# Altium project druino_uno.PrjPcb
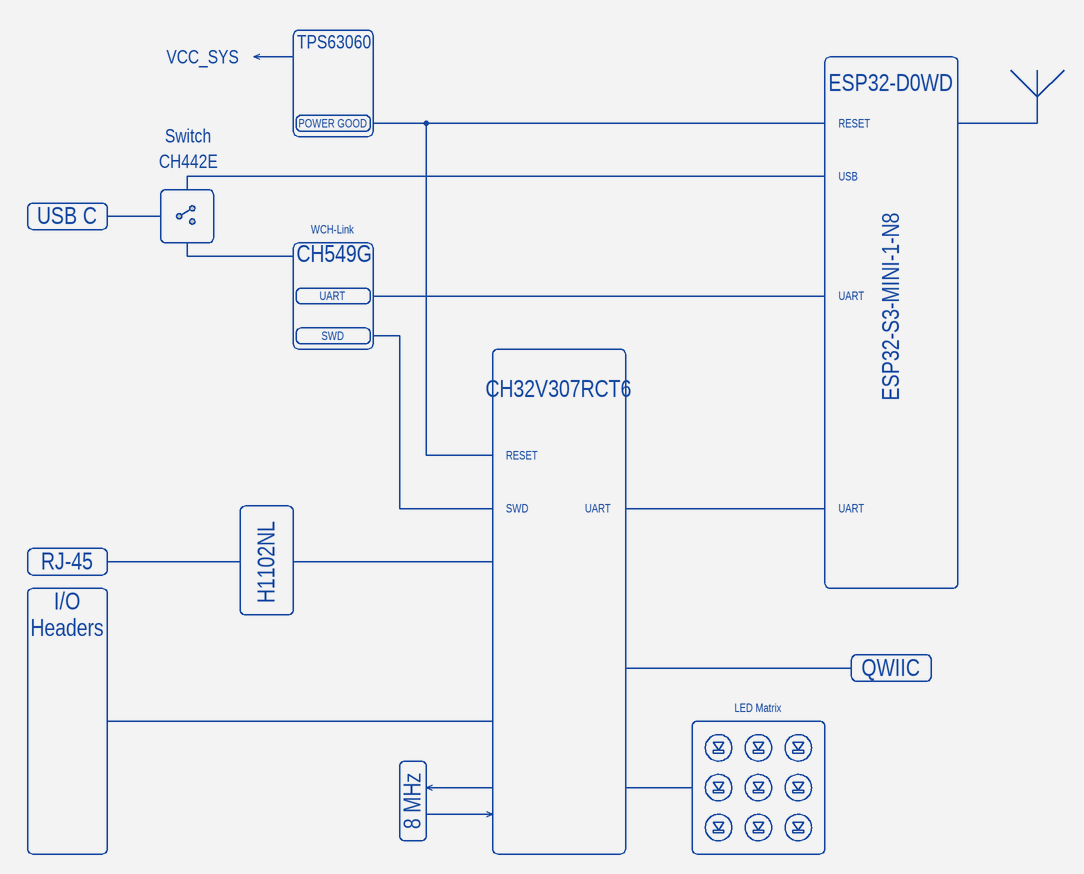
[diagram p0: p1_structure.SchDoc]
7 sheets, 210 parts. Net scope: global (net labels, ports and power ports of the same name join across sheets).
Board file: druino_uno_pcb.PcbDoc
Sheets:
  p1_structure.SchDoc
  p2_power_tree.SchDoc
  p3_mcu.SchDoc
  p4_esp32.SchDoc
  p6_wch_link.SchDoc
  p7_power.SchDoc
  p8_led_matrix.SchDoc

## Sheet p1_structure.SchDoc
size A4; Organization: ORGANIZATION; Address1: ADDRESS 1; Address2: ADDRESS 2; Address3: ADDRESS 3; Address4: ADDRESS 4; Revision: Rev. A; SheetNumber: 1; SheetTotal: 8; ENG_APP_DATE: --/--/--; DSN_APP_DATE: --/--/--; CHK_APP_DATE: --/--/--

### Notes on the sheet
- VCC_SYS
- TPS63060
- POWER GOOD
- RESET
- ESP32-D0WD
- Switch
- CH442E
- USB
- USB C
- WCH-Link
- CH549G
- UART
- SWD
- ESP32-S3-MINI-1-N8
- CH32V307RCT6
- RJ-45
- I/O
- H1102NL
- Headers
- QWIIC
- LED Matrix
- 8 MHz
- A4
- GitHub <https://github.com/kirra-cat/druino-uno>
- view on

## Sheet p2_power_tree.SchDoc
size A4; Organization: ORGANIZATION; Address1: ADDRESS 1; Address2: ADDRESS 2; Address3: ADDRESS 3; Address4: ADDRESS 4; Revision: Rev. A; SheetNumber: 2; SheetTotal: 8; ENG_APP_DATE: --/--/--; DSN_APP_DATE: --/--/--; CHK_APP_DATE: --/--/--
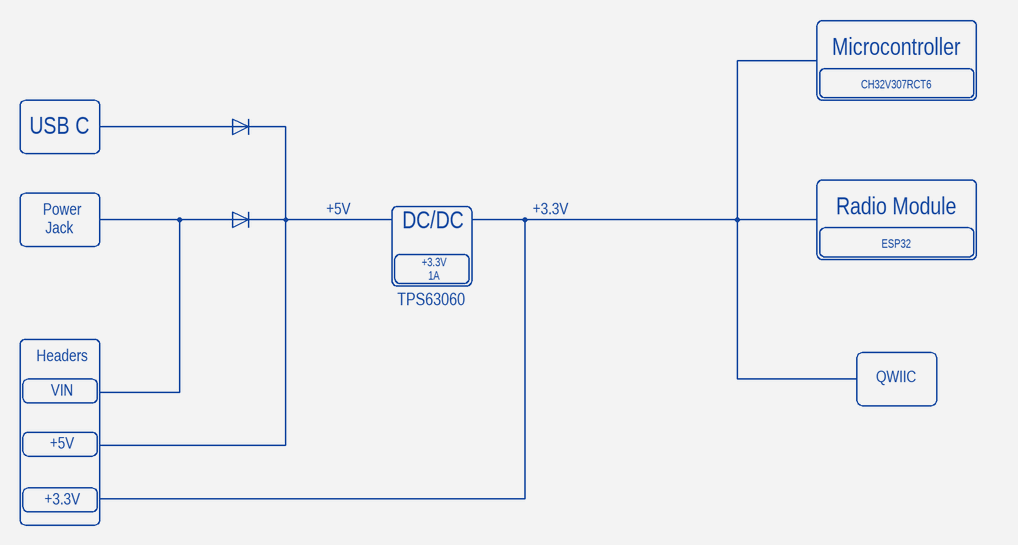
[diagram p1: p2_power_tree.SchDoc]

### Notes on the sheet
- Microcontroller
- USB C
- CH32V307RCT6
- Power
- Radio Module
- Jack
- +5V
- DC/DC
- +3.3V
- 1A
- ESP32
- TPS63060
- Headers
- VIN
- QWIIC
- A4
- GitHub <https://github.com/kirra-cat/druino-uno>
- view on

## Sheet p3_mcu.SchDoc
size A2; Organization: ORGANIZATION; Address1: ADDRESS 1; Address2: ADDRESS 2; Address3: ADDRESS 3; Address4: ADDRESS 4; Revision: Rev. A; SheetNumber: 3; SheetTotal: 8; ENG_APP_DATE: --/--/--; DSN_APP_DATE: --/--/--; CHK_APP_DATE: --/--/--
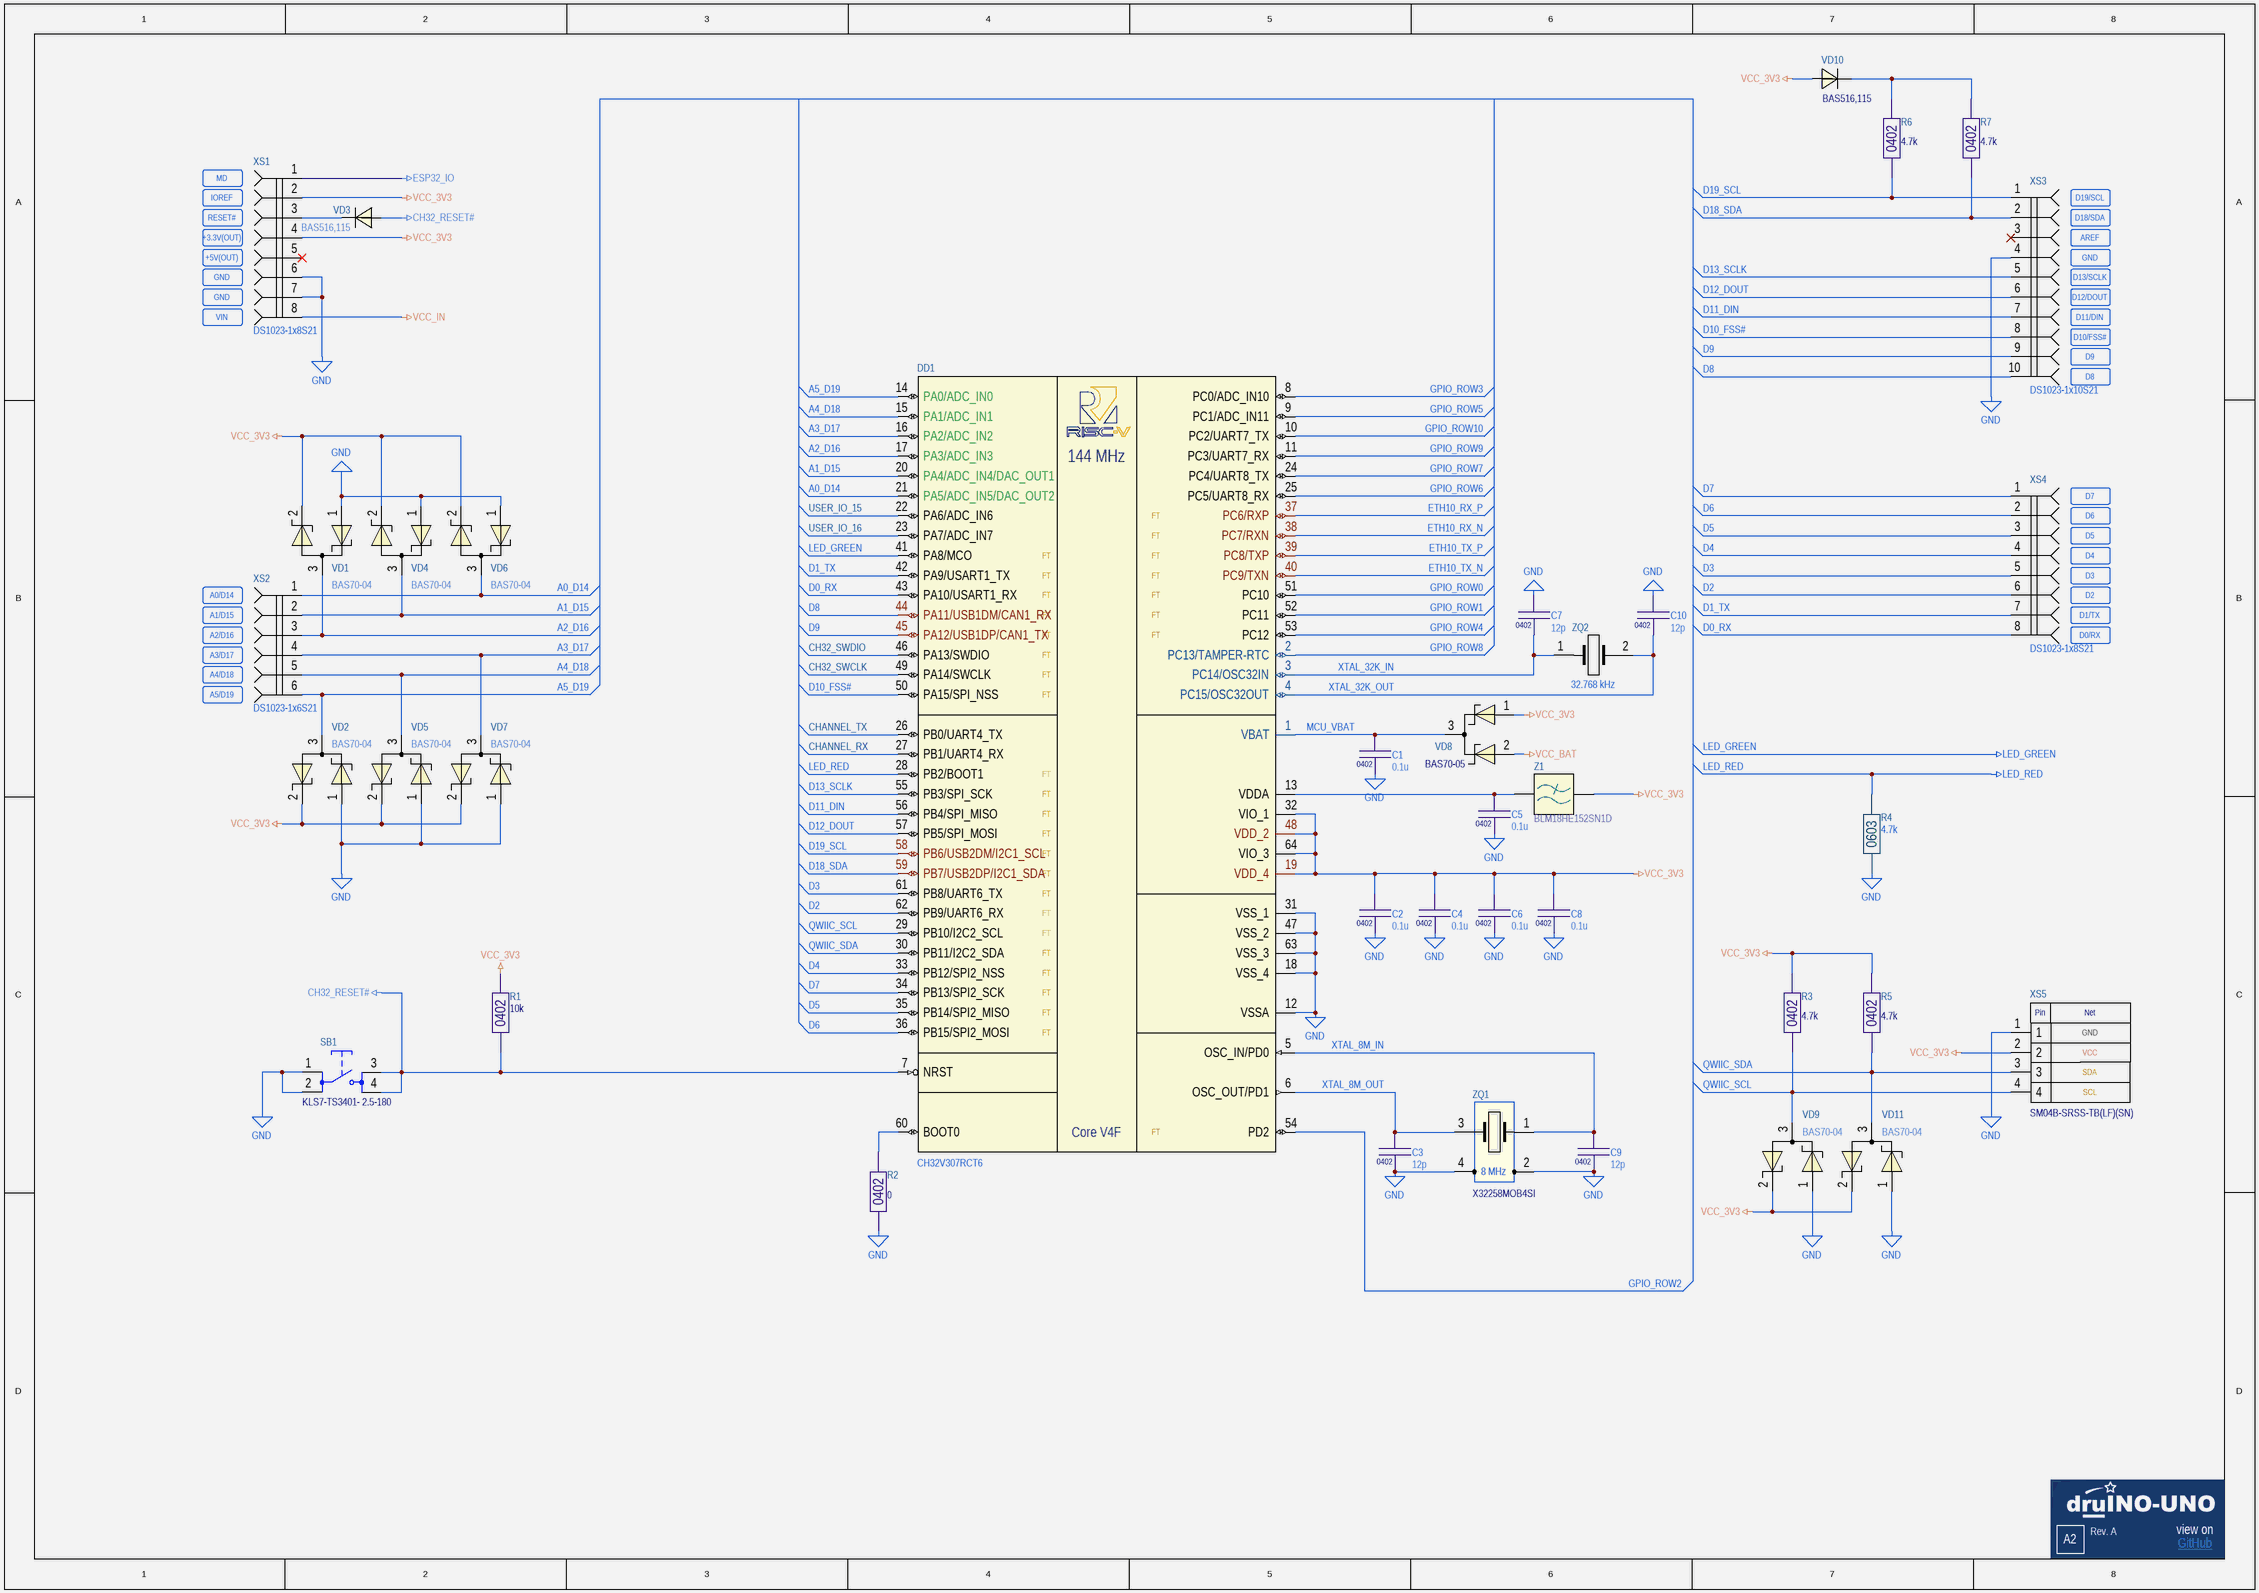
[diagram p2: p3_mcu.SchDoc]

### Parts
C1  0.1u  Package: 0402  [CAP0402]
C2  0.1u  Package: 0402  [CAP0402]
C3  12p  Package: 0402  [CAP0402]
C4  0.1u  Package: 0402  [CAP0402]
C5  0.1u  Package: 0402  [CAP0402]
C6  0.1u  Package: 0402  [CAP0402]
C7  12p  Package: 0402  [CAP0402]
C8  0.1u  Package: 0402  [CAP0402]
C9  12p  Package: 0402  [CAP0402]
C10  12p  Package: 0402  [CAP0402]
DD1  CH32V307RCT6  [LQFP64M]
R1  10k  Package: 0402  [RES0402B]
R2  0  Package: 0402  [RES0402B]
R3  4.7k  Package: 0402  [RES0402B]
R4  4.7k  Package: 0603  [RES0603B]
R5  4.7k  Package: 0402  [RES0402B]
R6  4.7k  Package: 0402  [RES0402B]
R7  4.7k  Package: 0402  [RES0402B]
SB1  KLS7-TS3401- 2.5-180  [TVAF11]
VD1  BAS70-04  [SOT23-3]
VD2  BAS70-04  [SOT23-3]
VD3  BAS516,115  [SOD-523]
VD4  BAS70-04  [SOT23-3]
VD5  BAS70-04  [SOT23-3]
VD6  BAS70-04  [SOT23-3]
VD7  BAS70-04  [SOT23-3]
VD8  BAS70-05  [SOT23-3]
VD9  BAS70-04  [SOT23-3]
VD10  BAS516,115  [SOD-523]
VD11  BAS70-04  [SOT23-3]
XS1  DS1023-1x8S21  [PBS-8(BLUE)]
XS2  DS1023-1x6S21  [PBS-6(blue)]
XS3  DS1023-1x10S21  [PBS-10(BLUE)]
XS4  DS1023-1x8S21  [PBS-8(BLUE)]
XS5  SM04B-SRSS-TB(LF)(SN)  [SM04B-SRSS-TB]
Z1  BLM18HE152SN1D  [BLM0603C]
ZQ1  X32258MOB4SI  [SMD3225]
ZQ2  X321532768KGD2SI  [YST310S]  (value not drawn)

### Nets
CH32_RESET#: DD1.7(NRST) R1.2 SB1.3 SB1.4 VD3.2
CH32_SWCLK: DD1.49(PA14/SWCLK)
CH32_SWDIO: DD1.46(PA13/SWDIO)
ESP32_IO: XS1.1
GND: C1.2 C2.2 C3.2 C4.2 C5.2 C6.2 C7.1 C8.2 C9.2 C10.1 DD1.12(VSSA) DD1.18(VSS_4) DD1.31(VSS_1) DD1.47(VSS_2) DD1.63(VSS_3) R2.2 R4.2 SB1.1 SB1.2 VD1.1(A1) VD2.1(A1) VD4.1(A1) VD5.1(A1) VD6.1(A1) VD7.1(A1) VD9.1(A1) VD11.1(A1) XS1.6 XS1.7 XS3.4 XS5.1 ZQ1.2(GND) ZQ1.4(GND)
LED_GREEN: DD1.41(PA8/MCO)
LED_RED: DD1.28(PB2/BOOT1) R4.1
VCC_3V3: C2.1 C4.1 C6.1 C8.1 DD1.19(VDD_4) DD1.32(VIO_1) DD1.48(VDD_2) DD1.64(VIO_3) R1.1 R3.1 R5.1 VD1.2(C) VD2.2(C) VD4.2(C) VD5.2(C) VD6.2(C) VD7.2(C) VD8.1(A1) VD9.2(C) VD10.2 VD11.2(C) XS1.2 XS1.4 XS5.2 Z1.1
VCC_BAT: VD8.2(C)
VCC_IN: XS1.8
A0_D14: DD1.21(PA5/ADC_IN5/DAC_OUT2) VD6.3(A2) XS2.1
A1_D15: DD1.20(PA4/ADC_IN4/DAC_OUT1) VD4.3(A2) XS2.2
A2_D16: DD1.17(PA3/ADC_IN3) VD1.3(A2) XS2.3
A3_D17: DD1.16(PA2/ADC_IN2) VD7.3(A2) XS2.4
A4_D18: DD1.15(PA1/ADC_IN1) VD5.3(A2) XS2.5
A5_D19: DD1.14(PA0/ADC_IN0) VD2.3(A2) XS2.6
CHANNEL_RX: DD1.27(PB1/UART4_RX)
CHANNEL_TX: DD1.26(PB0/UART4_TX)
D0_RX: DD1.43(PA10/USART1_RX) XS4.8
D1_TX: DD1.42(PA9/USART1_TX) XS4.7
D2: DD1.62(PB9/UART6_RX) XS4.6
D3: DD1.61(PB8/UART6_TX) XS4.5
D4: DD1.33(PB12/SPI2_NSS) XS4.4
D5: DD1.35(PB14/SPI2_MISO) XS4.3
D6: DD1.36(PB15/SPI2_MOSI) XS4.2
D7: DD1.34(PB13/SPI2_SCK) XS4.1
D8: DD1.44(PA11/USB1DM/CAN1_RX) XS3.10
D9: DD1.45(PA12/USB1DP/CAN1_TX) XS3.9
D10_FSS#: DD1.50(PA15/SPI_NSS) XS3.8
D11_DIN: DD1.56(PB4/SPI_MISO) XS3.7
D12_DOUT: DD1.57(PB5/SPI_MOSI) XS3.6
D13_SCLK: DD1.55(PB3/SPI_SCK) XS3.5
D18_SDA: DD1.59(PB7/USB2DP/I2C1_SDA) R7.2 XS3.2
D19_SCL: DD1.58(PB6/USB2DM/I2C1_SCL) R6.2 XS3.1
ETH10_RX_N: DD1.38(PC7/RXN)
ETH10_RX_P: DD1.37(PC6/RXP)
ETH10_TX_N: DD1.40(PC9/TXN)
ETH10_TX_P: DD1.39(PC8/TXP)
GPIO_ROW0: DD1.51(PC10)
GPIO_ROW1: DD1.52(PC11)
GPIO_ROW2: DD1.54(PD2)
GPIO_ROW3: DD1.8(PC0/ADC_IN10)
GPIO_ROW4: DD1.53(PC12)
GPIO_ROW5: DD1.9(PC1/ADC_IN11)
GPIO_ROW6: DD1.25(PC5/UART8_RX)
GPIO_ROW7: DD1.24(PC4/UART8_TX)
GPIO_ROW8: DD1.2(PC13/TAMPER-RTC)
GPIO_ROW9: DD1.11(PC3/UART7_RX)
GPIO_ROW10: DD1.10(PC2/UART7_TX)
MCU_VBAT: C1.1 DD1.1(VBAT) VD8.3(A2)
QWIIC_SCL: DD1.29(PB10/I2C2_SCL) R3.2 VD9.3(A2) XS5.4
QWIIC_SDA: DD1.30(PB11/I2C2_SDA) R5.2 VD11.3(A2) XS5.3
USER_IO_15: DD1.22(PA6/ADC_IN6)
USER_IO_16: DD1.23(PA7/ADC_IN7)
XTAL_8M_IN: C9.1 DD1.5(OSC_IN/PD0) ZQ1.1(XTAL0)
XTAL_8M_OUT: C3.1 DD1.6(OSC_OUT/PD1) ZQ1.3(XTAL1)
XTAL_32K_IN: C7.2 DD1.3(PC14/OSC32IN) ZQ2.1(XTAL0)
XTAL_32K_OUT: C10.2 DD1.4(PC15/OSC32OUT) ZQ2.2(XTAL1)
NetC5_1: C5.1 DD1.13(VDDA) Z1.2
NetDD1_60: DD1.60(BOOT0) R2.1
NetR6_1: R6.1 R7.1 VD10.1
NetVD3_1: VD3.1 XS1.3

Not connected (* = marked no-connect by the designer): XS1 5*; XS3 3*

### Notes on the sheet
- MD
- IOREF
- D19/SCL
- RESET#
- (near XS1) +3.3V(OUT)
- D18/SDA
- AREF
- +5V(OUT)
- GND
- D13/SCLK
- D12/DOUT
- VIN
- D11/DIN
- D10/FSS#
- D9
- D8
- D7
- (near DD1) FT
- D6
- D5
- A0/D14
- D4
- D3
- D2
- A1/D15
- A2/D16
- A3/D17
- D1/TX
- D0/RX
- A4/D18
- A5/D19
- A2
- GitHub <https://github.com/kirra-cat/druino-uno>
- view on
- (in symbol CH32V307RCT6) 144 MHz; Core V4F
- (in symbol SM04B-SRSS-TB) Pin; Net; GND; VCC; SDA; SCL
- (in symbol X32258MOB4SI) 8 MHz
- (in symbol X321532768KGD2SI) 32.768 kHz

### Library data of the parts
C1 C2 C4-C6 C8 = C0402: Capacitors 0402 package case; Part Number: TCC0402X7R104J500AT; Manufacturer: CCTC; Tolerance: ± 5 %; Dielectric: X7R; Voltage: 50 V; Value: 0.1u; Value on schem: 0.1u
C3 C7 C9 C10 = C0402: Capacitors 0402 package case; Part Number: TCC0402COG120F500AT; Manufacturer: CCTC; Tolerance: ± 1 %; Dielectric: NP0; Voltage: 50 V; Value: 12p; Value on schem: 12p
DD1 = CH32V307RCT6: RISC-V MCU 144MHz with 256KB flash, 64KB RAM; Manufacturer: WinChipHead; Package: LQFP-64; Part Number: CH32V307RCT6
R1 = R0402: Resistor 0402 package case; Part Number: RC0402FR-0710KL; Manufacturer: Yageo; Tolerance: ± 1 %; Temperature Coefficient: ±100 ppm/K; Value: 10k; Value on schem: 10k
R2 = R0402: Resistor 0402 package case; Part Number: RC0402FR-070RL; Manufacturer: Yageo; Tolerance: ± 1 %; Temperature Coefficient: ±100 ppm/K; Value: 0; Value on schem: 0
R3 R5-R7 = R0402: Resistor 0402 package case; Part Number: RC0402FR-074K7L; Manufacturer: Yageo; Tolerance: ± 1 %; Temperature Coefficient: ±100 ppm/K; Value: 4.7k; Value on schem: 4.7k
R4 = R0603: Resistor 0603 package case; Part Number: RC0603FR-074K7L; Manufacturer: Yageo; Tolerance: ± 1 %; Voltage: 100V; Temperature Coefficient: ±100/K; Value: 4.7k; Value on schem: 4.7k
SB1 = TVAF11: Tact Button SMD 4х3х2.5mm; Manufacturer: KLS; Package: 3x4mm; Part Number: KLS7-TS3401- 2.5-180
VD1 VD2 VD4-VD7 VD9 VD11 = BAS70-04: Small Signal Schottky Diodes; Manufacturer: Diodes Incorporated; Part Number: BAS70-04; Package: SOT23-3
VD3 VD10 = BAS516,115: High-speed switching diode; Manufacturer: NXP USA Inc.; Package: SOD-523; Part Number: BAS516,115
VD8 = BAS70-05: Small Signal Schottky Diodes; Manufacturer: Diodes Incorporated; Part Number: BAS70-05; Package: SOT23-3
XS1 XS4 = DS1023-1x8S21: 2.54mm Female Header V/T Type, H = 8.5mm; Manufacturer: Connfly; Part Number: DS1023-1x8S21
XS2 = DS1023-1x6S21: 2.54mm Female Header V/T Type, H = 8.5mm; Manufacturer: Connfly; Part Number: DS1023-1x6S21
XS3 = DS1023-1x10S21: 2.54mm Female Header V/T Type, H = 8.5mm; Manufacturer: Connfly; Part Number: DS1023-1x10S21
XS5 = SM04B-SRSS-TB: CONNECTOR, HEADER, SMT, R/A, 1MM, 4WAY; Manufacturer: JST; Part Number: SM04B-SRSS-TB(LF)(SN)
Z1 = BLM18HE152SN1D: Power line filter, imperdance 1500 Ohm @100MHz (current 0.5A); Manufacturer: Murata; Part Number: BLM18HE152SN1D; Package: 0603
ZQ1 = X32258MOB4SI: Quartz Crystal 8 MHz; Manufacturer: YXC; Load Capacitance: 12pF; Frequency Tolerance: ±20ppm; Frequency Stability: ±30ppm; ESR (Equivalent Series Resistance): 70 Ohms; Operating Mode: Fundamental; Part Number: X32258MOB4SI; Package: SMD3225
ZQ2 = X321532768KGD2SI: Quartz Crystal 32768 Hz; Manufacturer: YXC; Load Capacitance: 12.5 pF; Frequency Tolerance: ±20ppm; Frequency Stability: ±30ppm; ESR (Equivalent Series Resistance): 70 Ohms; Operating Mode: Fundamental; Part Number: X321532768KGD2SI; Package: SMD3215

## Sheet p4_esp32.SchDoc
size A2; Organization: ORGANIZATION; Address1: ADDRESS 1; Address2: ADDRESS 2; Address3: ADDRESS 3; Address4: ADDRESS 4; Revision: Rev. A; SheetNumber: 4; SheetTotal: 8; ENG_APP_DATE: --/--/--; DSN_APP_DATE: --/--/--; CHK_APP_DATE: --/--/--
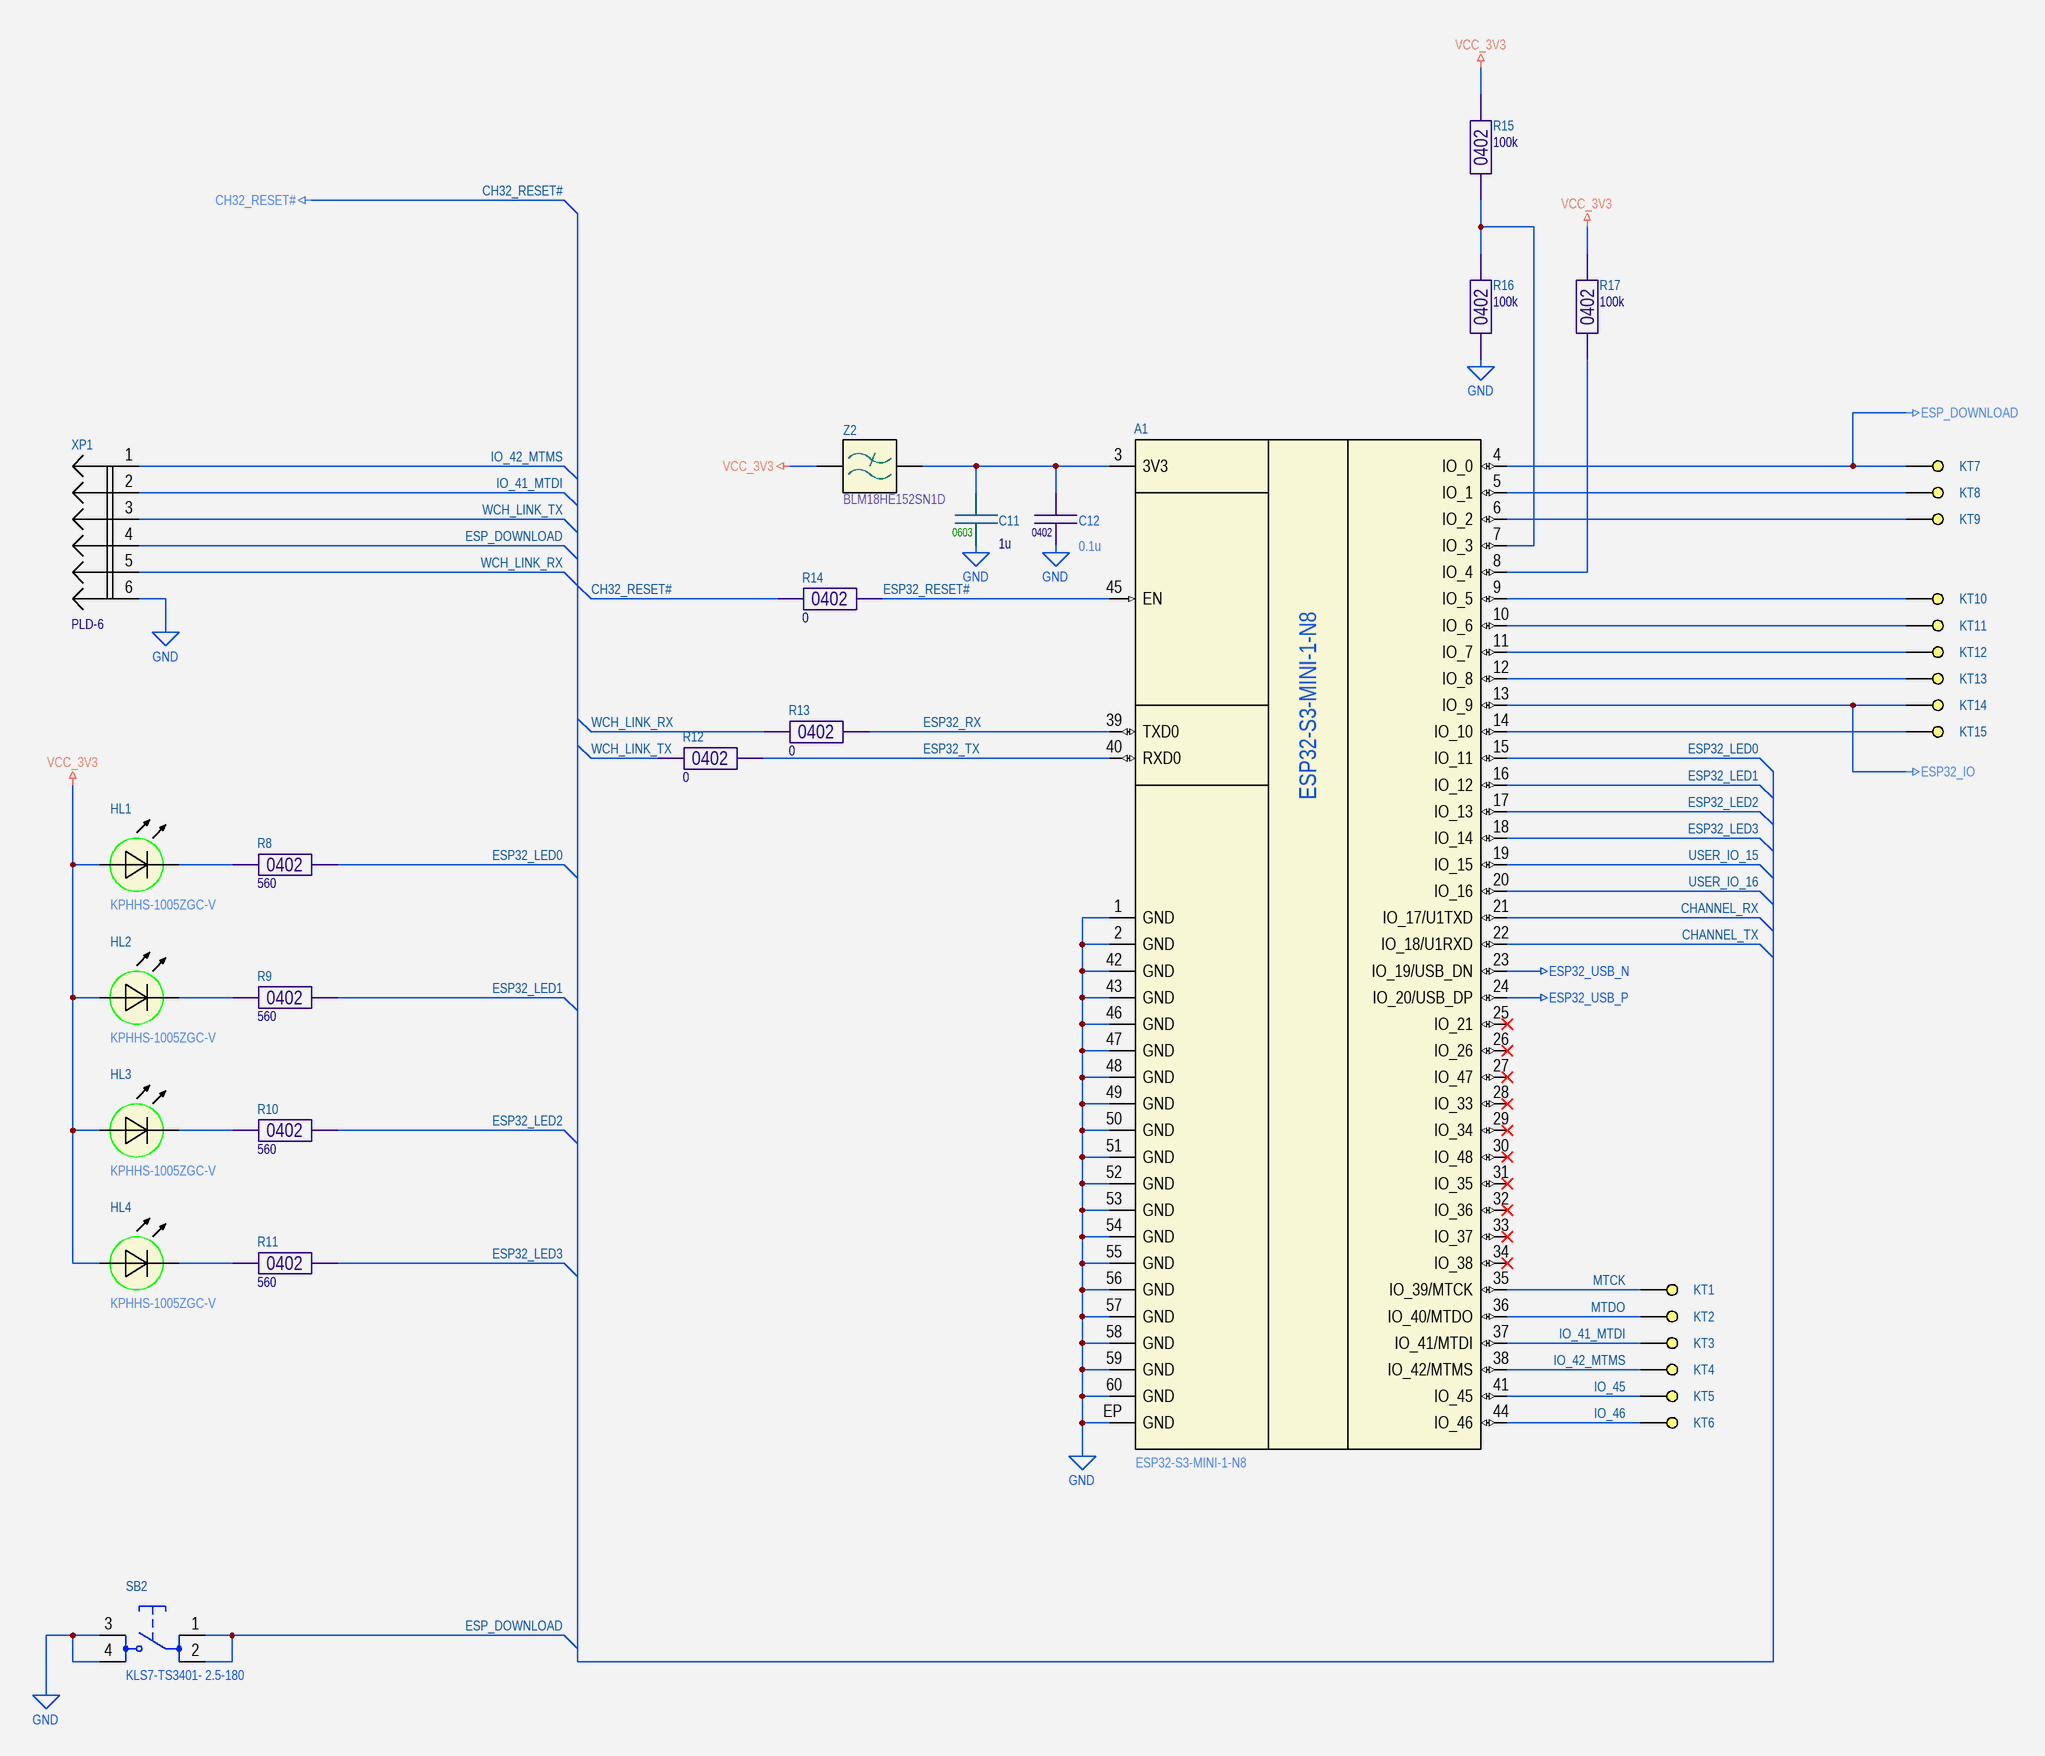
[diagram p3: p4_esp32.SchDoc]

### Parts
A1  ESP32-S3-MINI-1-N8  [ESP32-S3-MINI-1]
C11  1u  Package: 0603  [CAP0603]
C12  0.1u  Package: 0402  [CAP0402]
HL1  KPHHS-1005ZGC-V  [LED0402G525]
HL2  KPHHS-1005ZGC-V  [LED0402G525]
HL3  KPHHS-1005ZGC-V  [LED0402G525]
HL4  KPHHS-1005ZGC-V  [LED0402G525]
KT1  TEST_PAD  [TEST_PAD_R1mm]  (value not drawn)  (net tie, no BOM)
KT2  TEST_PAD  [TEST_PAD_R1mm]  (value not drawn)  (net tie, no BOM)
KT3  TEST_PAD  [TEST_PAD_R1mm]  (value not drawn)  (net tie, no BOM)
KT4  TEST_PAD  [TEST_PAD_R1mm]  (value not drawn)  (net tie, no BOM)
KT5  TEST_PAD  [TEST_PAD_R1mm]  (value not drawn)  (net tie, no BOM)
KT6  TEST_PAD  [TEST_PAD_R1mm]  (value not drawn)  (net tie, no BOM)
KT7  TEST_PAD  [TEST_PAD_R1mm]  (value not drawn)  (net tie, no BOM)
KT8  TEST_PAD  [TEST_PAD_R1mm]  (value not drawn)  (net tie, no BOM)
KT9  TEST_PAD  [TEST_PAD_R1mm]  (value not drawn)  (net tie, no BOM)
KT10  TEST_PAD  [TEST_PAD_R1mm]  (value not drawn)  (net tie, no BOM)
KT11  TEST_PAD  [TEST_PAD_R1mm]  (value not drawn)  (net tie, no BOM)
KT12  TEST_PAD  [TEST_PAD_R1mm]  (value not drawn)  (net tie, no BOM)
KT13  TEST_PAD  [TEST_PAD_R1mm]  (value not drawn)  (net tie, no BOM)
KT14  TEST_PAD  [TEST_PAD_R1mm]  (value not drawn)  (net tie, no BOM)
KT15  TEST_PAD  [TEST_PAD_R1mm]  (value not drawn)  (net tie, no BOM)
R8  560  Package: 0402  [RES0402B]
R9  560  Package: 0402  [RES0402B]
R10  560  Package: 0402  [RES0402B]
R11  560  Package: 0402  [RES0402B]
R12  0  Package: 0402  [RES0402B]
R13  0  Package: 0402  [RES0402B]
R14  0  Package: 0402  [RES0402B]
R15  100k  Package: 0402  [RES0402B]
R16  100k  Package: 0402  [RES0402B]
R17  100k  Package: 0402  [RES0402B]
SB2  KLS7-TS3401- 2.5-180  [TVAF11]
XP1  PLD-6  [PLD-6]
Z2  BLM18HE152SN1D  [BLM0603C]

### Nets
CH32_RESET#: R14.2
ESP32_IO: A1.13(IO_9) KT14.1
ESP32_USB_N: A1.23(IO_19/USB_DN)
ESP32_USB_P: A1.24(IO_20/USB_DP)
ESP_DOWNLOAD: A1.4(IO_0) KT7.1 SB2.1 SB2.2 XP1.4
GND: A1.1(GND) A1.2(GND) A1.42(GND) A1.43(GND) A1.46(GND) A1.47(GND) A1.48(GND) A1.49(GND) A1.50(GND) A1.51(GND) A1.52(GND) A1.53(GND) A1.54(GND) A1.55(GND) A1.56(GND) A1.57(GND) A1.58(GND) A1.59(GND) A1.60(GND) A1.EP(GND) C11.1 C12.2 R16.2 SB2.3 SB2.4 XP1.6
VCC_3V3: HL1.2 HL2.2 HL3.2 HL4.2 R15.1 R17.1 Z2.2
WCH_LINK_RX: R13.1 XP1.5
WCH_LINK_TX: R12.1 XP1.3
CHANNEL_RX: A1.21(IO_17/U1TXD)
CHANNEL_TX: A1.22(IO_18/U1RXD)
ESP32_LED0: A1.15(IO_11) R8.2
ESP32_LED1: A1.16(IO_12) R9.2
ESP32_LED2: A1.17(IO_13) R10.2
ESP32_LED3: A1.18(IO_14) R11.2
ESP32_RESET#: A1.45(EN) R14.1
ESP32_RX: A1.39(TXD0) R13.2
ESP32_TX: A1.40(RXD0) R12.2
IO_41_MTDI: A1.37(IO_41/MTDI) KT3.1 XP1.2
IO_42_MTMS: A1.38(IO_42/MTMS) KT4.1 XP1.1
IO_45: A1.41(IO_45) KT5.1
IO_46: A1.44(IO_46) KT6.1
MTCK: A1.35(IO_39/MTCK) KT1.1
MTDO: A1.36(IO_40/MTDO) KT2.1
USER_IO_15: A1.19(IO_15)
USER_IO_16: A1.20(IO_16)
NetA1_3: A1.3(3V3) C11.2 C12.1 Z2.1
NetA1_5: A1.5(IO_1) KT8.1
NetA1_6: A1.6(IO_2) KT9.1
NetA1_7: A1.7(IO_3) R15.2 R16.1
NetA1_8: A1.8(IO_4) R17.2
NetA1_9: A1.9(IO_5) KT10.1
NetA1_10: A1.10(IO_6) KT11.1
NetA1_11: A1.11(IO_7) KT12.1
NetA1_12: A1.12(IO_8) KT13.1
NetA1_14: A1.14(IO_10) KT15.1
NetHL1_1: HL1.1 R8.1
NetHL2_1: HL2.1 R9.1
NetHL3_1: HL3.1 R10.1
NetHL4_1: HL4.1 R11.1

Not connected (* = marked no-connect by the designer): A1 25(IO_21)* 26(IO_26)* 27(IO_47)* 28(IO_33)* 29(IO_34)* 30(IO_48)* 31(IO_35)* 32(IO_36)* 33(IO_37)* 34(IO_38)*

### Notes on the sheet
- A2
- GitHub <https://github.com/kirra-cat/druino-uno>
- view on

### Library data of the parts
A1 = ESP32-S3-MINI-1-N8: 2.4 GHz WiFi + Bluetooth® + Bluetooth LE module; Manufacturer: Espressif Systems; Part Number: ESP32-S3-MINI-1-N8
C11 = C0603: Capacitors 0603 package case; Part Number: TCC0603X7R106M6R3CT; Manufacturer: CCTC; Tolerance: ± 20 %; Dielectric: X7R; Voltage: 6.3V; Value: 1u; Value on schem: 1u
C12 = C0402: as C1 on sheet p3_mcu; Value: 0.1u; Value on schem: 0.1u
HL1-HL4 = KPHHS-1005ZGC-V: Green led (package case 0402); Manufacturer: Kingbright Company LLC.; Designator: HL*; Forward Current: 20 mA; Forward Voltage: 3.3V; Wavelength: 515 nm; Package: 0402; Part Number: KPHHS-1005ZGC-V; Color: Green
KT1-KT15 = TEST_PAD: Test pad
R8-R11 = R0402: Resistor 0402 package case; Part Number: RC0402FR-07560RL; Manufacturer: Yageo; Tolerance: ± 1 %; Temperature Coefficient: ±100 ppm/K; Value: 560; Value on schem: 560
R12-R14 = R0402: as R2 on sheet p3_mcu; Value: 0; Value on schem: 0
R15-R17 = R0402: Resistor 0402 package case; Part Number: RC0402FR-07100KL; Manufacturer: Yageo; Tolerance: ± 1 %; Temperature Coefficient: ±100 ppm/K; Value: 100k; Value on schem: 100k
SB2 = TVAF11: as SB1 on sheet p3_mcu; Package: 3x4mm; Part Number: KLS7-TS3401- 2.5-180
Z2 = BLM18HE152SN1D: as Z1 on sheet p3_mcu; Part Number: BLM18HE152SN1D; Package: 0603
XP1 = PLD-6: Value: PLD-6

## Sheet p6_wch_link.SchDoc
size A3; Organization: ORGANIZATION; Address1: ADDRESS 1; Address2: ADDRESS 2; Address3: ADDRESS 3; Address4: ADDRESS 4; Revision: Rev. A; SheetNumber: 6; SheetTotal: 8; ENG_APP_DATE: --/--/--; DSN_APP_DATE: --/--/--; CHK_APP_DATE: --/--/--
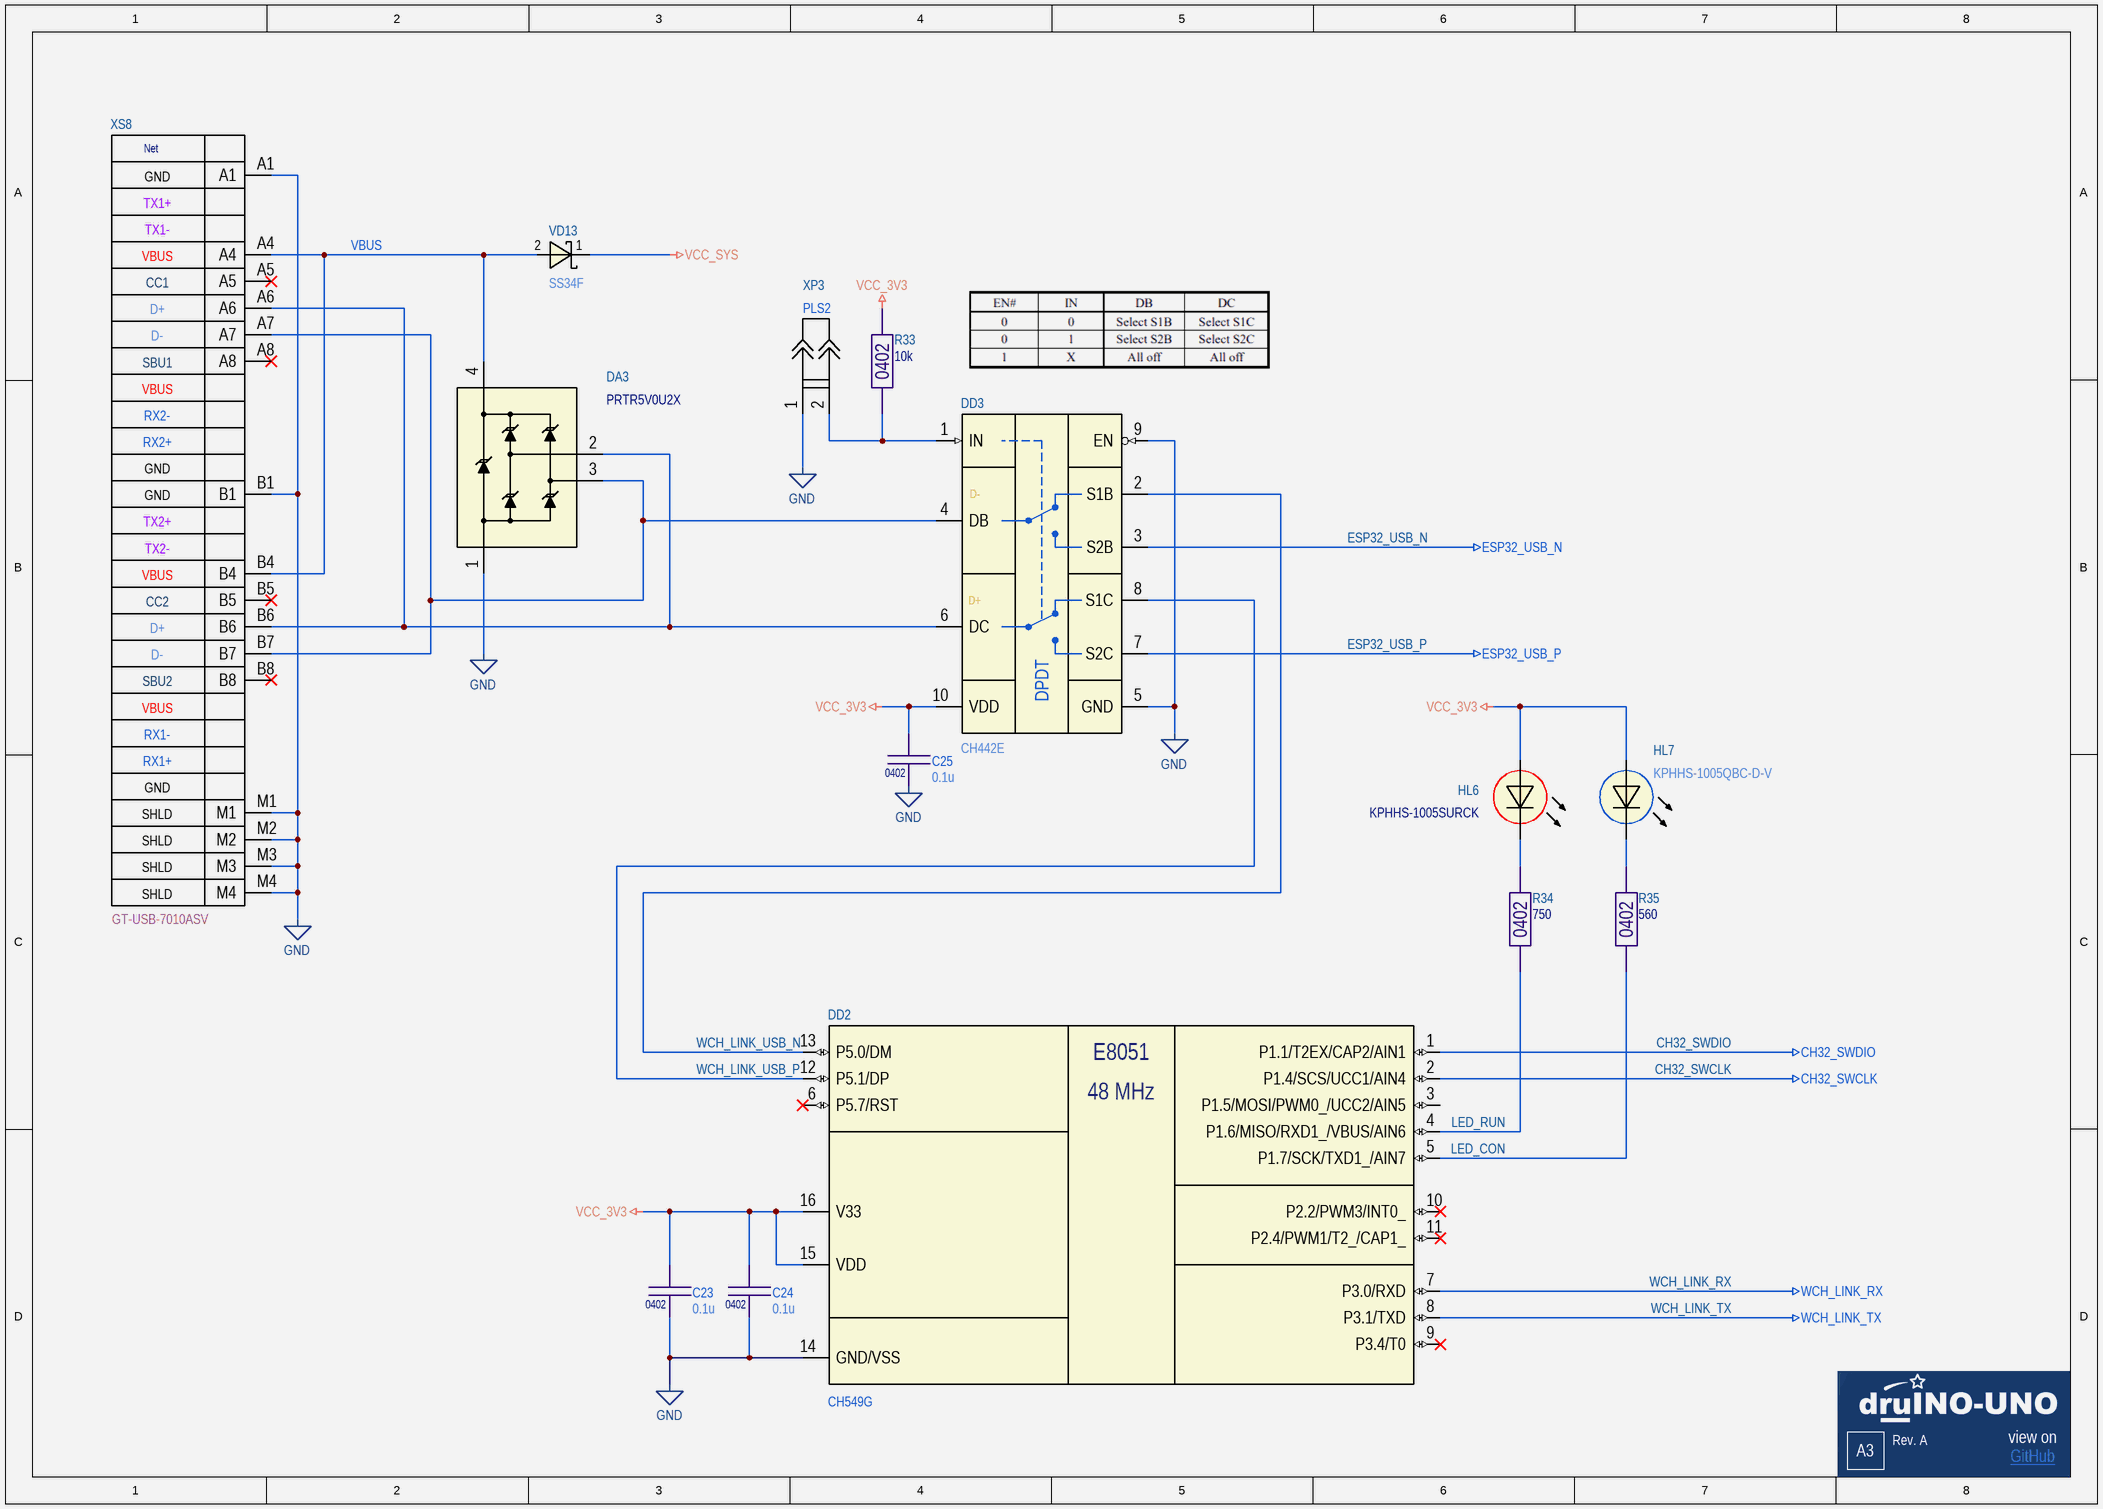
[diagram p4: p6_wch_link.SchDoc]

### Parts
C23  0.1u  Package: 0402  [CAP0402]
C24  0.1u  Package: 0402  [CAP0402]
C25  0.1u  Package: 0402  [CAP0402]
DA3  PRTR5V0U2X  [SOT143]
DD2  CH549G  [SOIC-16]
DD3  CH442E  [MSOP-10]
HL6  KPHHS-1005SURCK  [LED0402R]
HL7  KPHHS-1005QBC-D-V  [LED0402B]
R33  10k  Package: 0402  [RES0402B]
R34  750  Package: 0402  [RES0402B]
R35  560  Package: 0402  [RES0402B]
VD13  SS34F  [SMA-FL]
XP3  PLS2  [PLS-2]
XS8  GT-USB-7010ASV  [GT-USB-7010ASV]

### Nets
CH32_SWCLK: DD2.2(P1.4/SCS/UCC1/AIN4)
CH32_SWDIO: DD2.1(P1.1/T2EX/CAP2/AIN1)
ESP32_USB_N: DD3.3(S2B)
ESP32_USB_P: DD3.7(S2C)
GND: C23.2 C24.2 C25.2 DA3.1(GND) DD2.14(GND/VSS) DD3.5(GND) DD3.9(EN) XP3.1 XS8.A1 XS8.B1 XS8.M1 XS8.M2 XS8.M3 XS8.M4
VCC_3V3: C23.1 C24.1 C25.1 DD2.15(VDD) DD2.16(V33) DD3.10(VDD) HL6.2 HL7.2 R33.1
VCC_SYS: VD13.1
WCH_LINK_RX: DD2.7(P3.0/RXD)
WCH_LINK_TX: DD2.8(P3.1/TXD)
LED_CON: DD2.5(P1.7/SCK/TXD1_/AIN7) R35.2
LED_RUN: DD2.4(P1.6/MISO/RXD1_/VBUS/AIN6) R34.2
VBUS: DA3.4(VCC) VD13.2 XS8.A4 XS8.B4
WCH_LINK_USB_N: DD2.13(P5.0/DM) DD3.2(S1B)
WCH_LINK_USB_P: DD2.12(P5.1/DP) DD3.8(S1C)
NetDA3_2: DA3.2(IO1) DD3.6(DC) XS8.A6 XS8.B6
NetDA3_3: DA3.3(IO2) DD3.4(DB) XS8.A7 XS8.B7
NetDD3_1: DD3.1(IN) R33.2 XP3.2
NetHL6_1: HL6.1 R34.1
NetHL7_1: HL7.1 R35.1

Not connected (* = marked no-connect by the designer): DD2 3(P1.5/MOSI/PWM0_/UCC2/AIN5) 6(P5.7/RST)* 9(P3.4/T0)* 10(P2.2/PWM3/INT0_)* 11(P2.4/PWM1/T2_/CAP1_)*; XS8 A5* A8* B5* B8*

### Notes on the sheet
- (near DD3) D-
- (near DD3) D+
- A3
- GitHub <https://github.com/kirra-cat/druino-uno>
- view on
- (in symbol CH442E) DPDT
- (in symbol CH549G) E8051; 48 MHz
- (in symbol GT-USB-7010ASV) Net; GND; TX1+; TX1-; VBUS; CC1; D+; D-; SBU1; RX2-; RX2+; TX2+; TX2-; CC2; SBU2; RX1-; RX1+; SHLD

### Library data of the parts
C23-C25 = C0402: as C1 on sheet p3_mcu; Value: 0.1u; Value on schem: 0.1u
DA3 = PRTR5V0U2X: Ultra low capacitance double rail-to-rail ESD protection diode; Manufacturer: NXP USA Inc.; Part Number: PRTR5V0U2X; Package: SOT-143
DD2 = CH549G: 8-bit Enhanced USB MCU; Manufacturer: WinChipHead; Package: SOP16; Part Number: CH549G
DD3 = CH442E: Double-pole Double-throw Low-Resistance Analog Switch IC; Manufacturer: WinChipHead; Package: MSOP-10; Part Number: CH442E
HL6 = KPHHS-1005SURCK: Red led (package case 0402); Manufacturer: Kingbright Company LLC.; Designator: HL*; Forward Current: 20 mA; Forward Voltage: 1.95V; Wavelength: 630 nm; Package: 0402; Part Number: KPHHS-1005SURCK; Color: Red
HL7 = KPHHS-1005QBC-D-V: Blue led (package case 0402); Manufacturer: Kingbright Company LLC.; Designator: HL*; Forward Current: 20 mA; Forward Voltage: 3.3V; Wavelength: 465 nm; Package: 0402; Part Number: KPHHS-1005QBC-D-V; Color: Blue
R33 = R0402: as R1 on sheet p3_mcu; Value: 10k; Value on schem: 10k
R34 = R0402: Resistor 0402 package case; Part Number: RC0402FR-07750RL; Manufacturer: Yageo; Tolerance: ± 1 %; Temperature Coefficient: ±100 ppm/K; Value: 750; Value on schem: 750
R35 = R0402: as R8 on sheet p4_esp32; Value: 560; Value on schem: 560
VD13 = SS34F: 3A Schottky barrier rectifier; Manufacturer: UMW; Package: SMAF; Part Number: SS34F
XS8 = GT-USB-7010ASV: USB 2.0 Female 3A Surface 16P; Manufacturer: G-Switch; Part Number: GT-USB-7010ASV
XP3 = PLS2: Value: PLS2

## Sheet p7_power.SchDoc
size A4; Organization: ORGANIZATION; Address1: ADDRESS 1; Address2: ADDRESS 2; Address3: ADDRESS 3; Address4: ADDRESS 4; Revision: Rev. A; SheetNumber: 7; SheetTotal: 8; ENG_APP_DATE: --/--/--; DSN_APP_DATE: --/--/--; CHK_APP_DATE: --/--/--
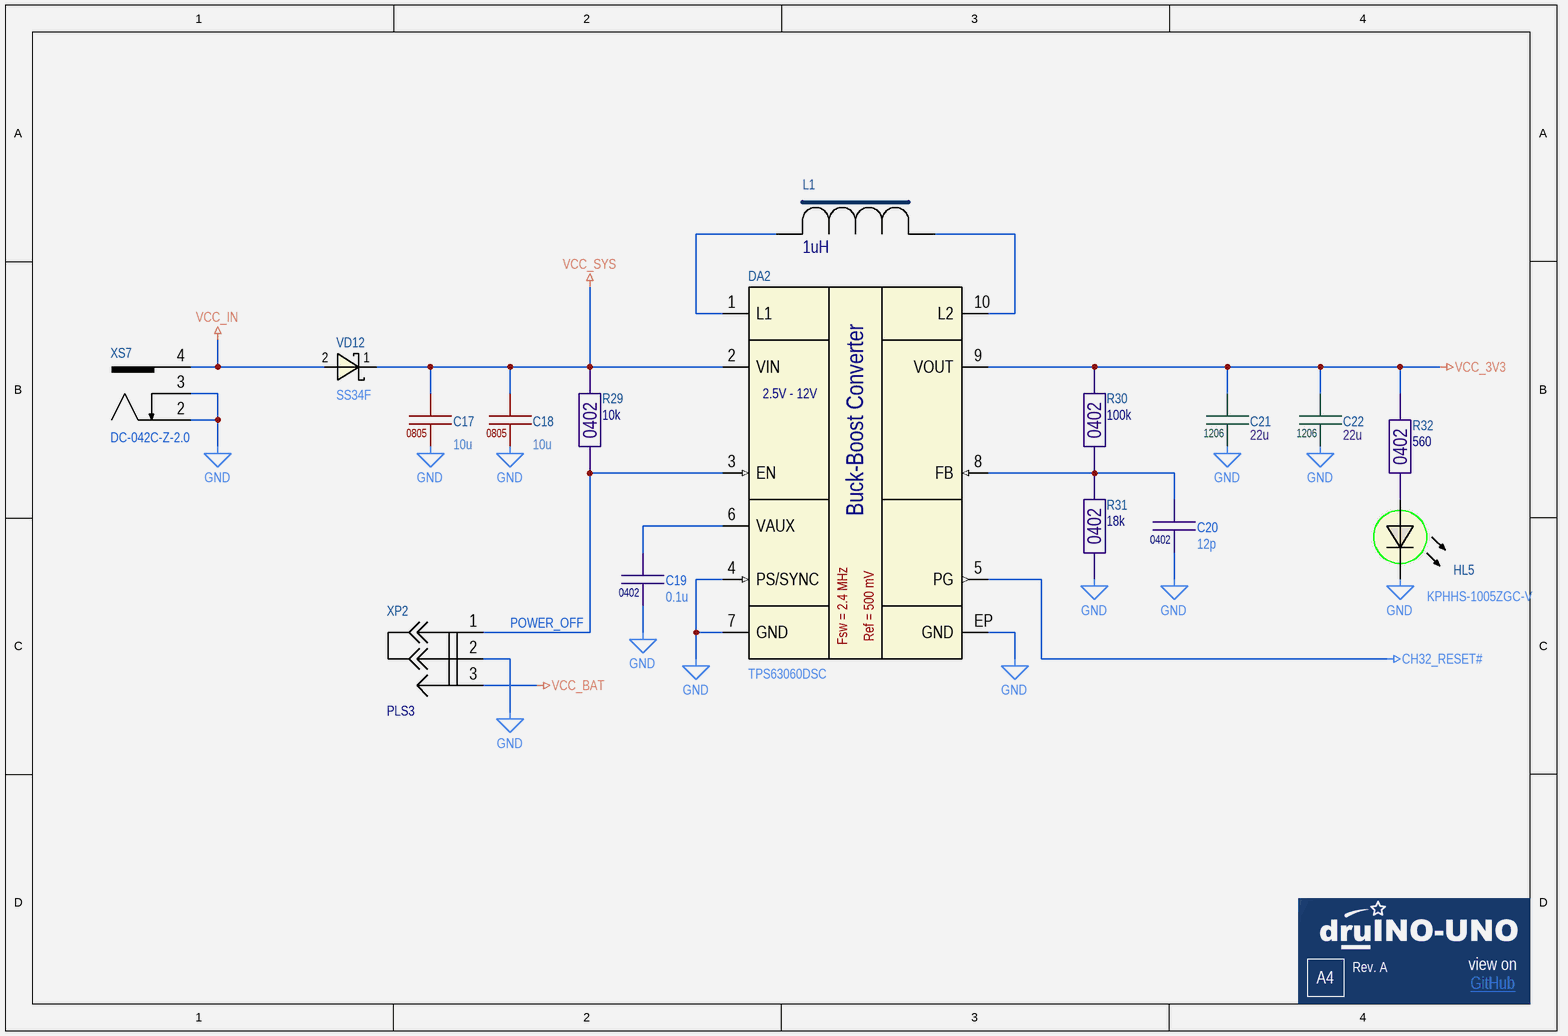
[diagram p5: p7_power.SchDoc]

### Parts
C17  10u  Package: 0805  [CAP0805-0.75]
C18  10u  Package: 0805  [CAP0805-0.75]
C19  0.1u  Package: 0402  [CAP0402]
C20  12p  Package: 0402  [CAP0402]
C21  22u  Package: 1206  [CAP1206-1.8]
C22  22u  Package: 1206  [CAP1206-1.8]
DA2  TPS63060DSC  [PWSON-10]
HL5  KPHHS-1005ZGC-V  [LED0402G525]
L1  Inductance @ 100 kHz: 1uH  [IHLP1616]  (hidden comment: IHLP2020BZERR22M01)
R29  10k  Package: 0402  [RES0402B]
R30  100k  Package: 0402  [RES0402B]
R31  18k  Package: 0402  [RES0402B]
R32  560  Package: 0402  [RES0402B]
VD12  SS34F  [SMA-FL]
XP2  PLS3  [PLS-3]
XS7  DC-042C-Z-2.0  [DC-042C-Z-2.0]

### Nets
CH32_RESET#: DA2.5(PG)
GND: C17.1 C18.1 C19.2 C20.2 C21.1 C22.1 DA2.4(PS/SYNC) DA2.7(GND) DA2.EP(GND) HL5.1 R31.2 XP2.2 XS7.2 XS7.3
VCC_3V3: C21.2 C22.2 DA2.9(VOUT) R30.1 R32.2
VCC_BAT: XP2.3
VCC_IN: VD12.2 XS7.4
VCC_SYS: C17.2 C18.2 DA2.2(VIN) R29.1 VD12.1
POWER_OFF: DA2.3(EN) R29.2 XP2.1
NetC19_1: C19.1 DA2.6(VAUX)
NetC20_1: C20.1 DA2.8(FB) R30.2 R31.1
NetDA2_1: DA2.1(L1) L1.1
NetDA2_10: DA2.10(L2) L1.2
NetHL5_2: HL5.2 R32.1

### Notes on the sheet
- A4
- GitHub <https://github.com/kirra-cat/druino-uno>
- view on
- (in symbol TPS63060DSC) 2.5V - 12V; Buck-Boost Converter; Fsw = 2.4 MHz; Ref = 500 mV

### Library data of the parts
C17 C18 = C0805: Capacitors 0805 package case; Part Number: TCC0805X7R106K250FT; Manufacturer: CCTC; Tolerance: ± 10 %; Dielectric: X7R; Voltage: 25V; Value: 10u; Value on schem: 10u
C19 = C0402: as C1 on sheet p3_mcu; Value: 0.1u; Value on schem: 0.1u
C20 = C0402: as C3 on sheet p3_mcu; Value: 12p; Value on schem: 12p
C21 C22 = C1206: Capacitors 1206 package case; Part Number: TCC1206X7R226M160HT; Manufacturer: CCTC; Tolerance: ± 20 %; Dielectric: X7R; Voltage: 16V; Value: 22u; Value on schem: 22u
DA2 = TPS63060DSC: High Input Voltage, 2A Buck-Boost Converter; Manufacturer: Texas Instruments; Part Number: TPS63060DSC; Package: PWSON-10
HL5 = KPHHS-1005ZGC-V: as HL1 on sheet p4_esp32; Package: 0402; Part Number: KPHHS-1005ZGC-V; Color: Green
L1 = IHLP1616BZER1R0M01: Shielded SMD Power Inductors; Manufacturer: Vishay Dale; RDC: 27 mOhm; SRF Min: 64 MHz; Irms  Max: 4.5 A; Isat  Typ: 5 A; Part Number: IHLP2020BZERR22M01; Package: 4.06mm x 4.06mm
R29 = R0402: as R1 on sheet p3_mcu; Value: 10k; Value on schem: 10k
R30 = R0402: as R15 on sheet p4_esp32; Value: 100k; Value on schem: 100k
R31 = R0402: Resistor 0402 package case; Part Number: RC0402FR-0718KL; Manufacturer: Yageo; Tolerance: ± 1 %; Temperature Coefficient: ±100 ppm/K; Value: 18k; Value on schem: 18k
R32 = R0402: as R8 on sheet p4_esp32; Value: 560; Value on schem: 560
VD12 = SS34F: as VD13 on sheet p6_wch_link; Package: SMAF; Part Number: SS34F
XS7 = DC-042C-Z-2.0: Shrouded DC Power Receptacle 2mm 6.3mm 8A 24V; Manufacturer: XKB Connectivity; Part Number: DC-042C-Z-2.0
XP2 = PLS3: Value: PLS3

## Sheet p8_led_matrix.SchDoc
size A1; Organization: ORGANIZATION; Address1: ADDRESS 1; Address2: ADDRESS 2; Address3: ADDRESS 3; Address4: ADDRESS 4; Revision: Rev. A; SheetNumber: 8; SheetTotal: 8; ENG_APP_DATE: --/--/--; DSN_APP_DATE: --/--/--; CHK_APP_DATE: --/--/--
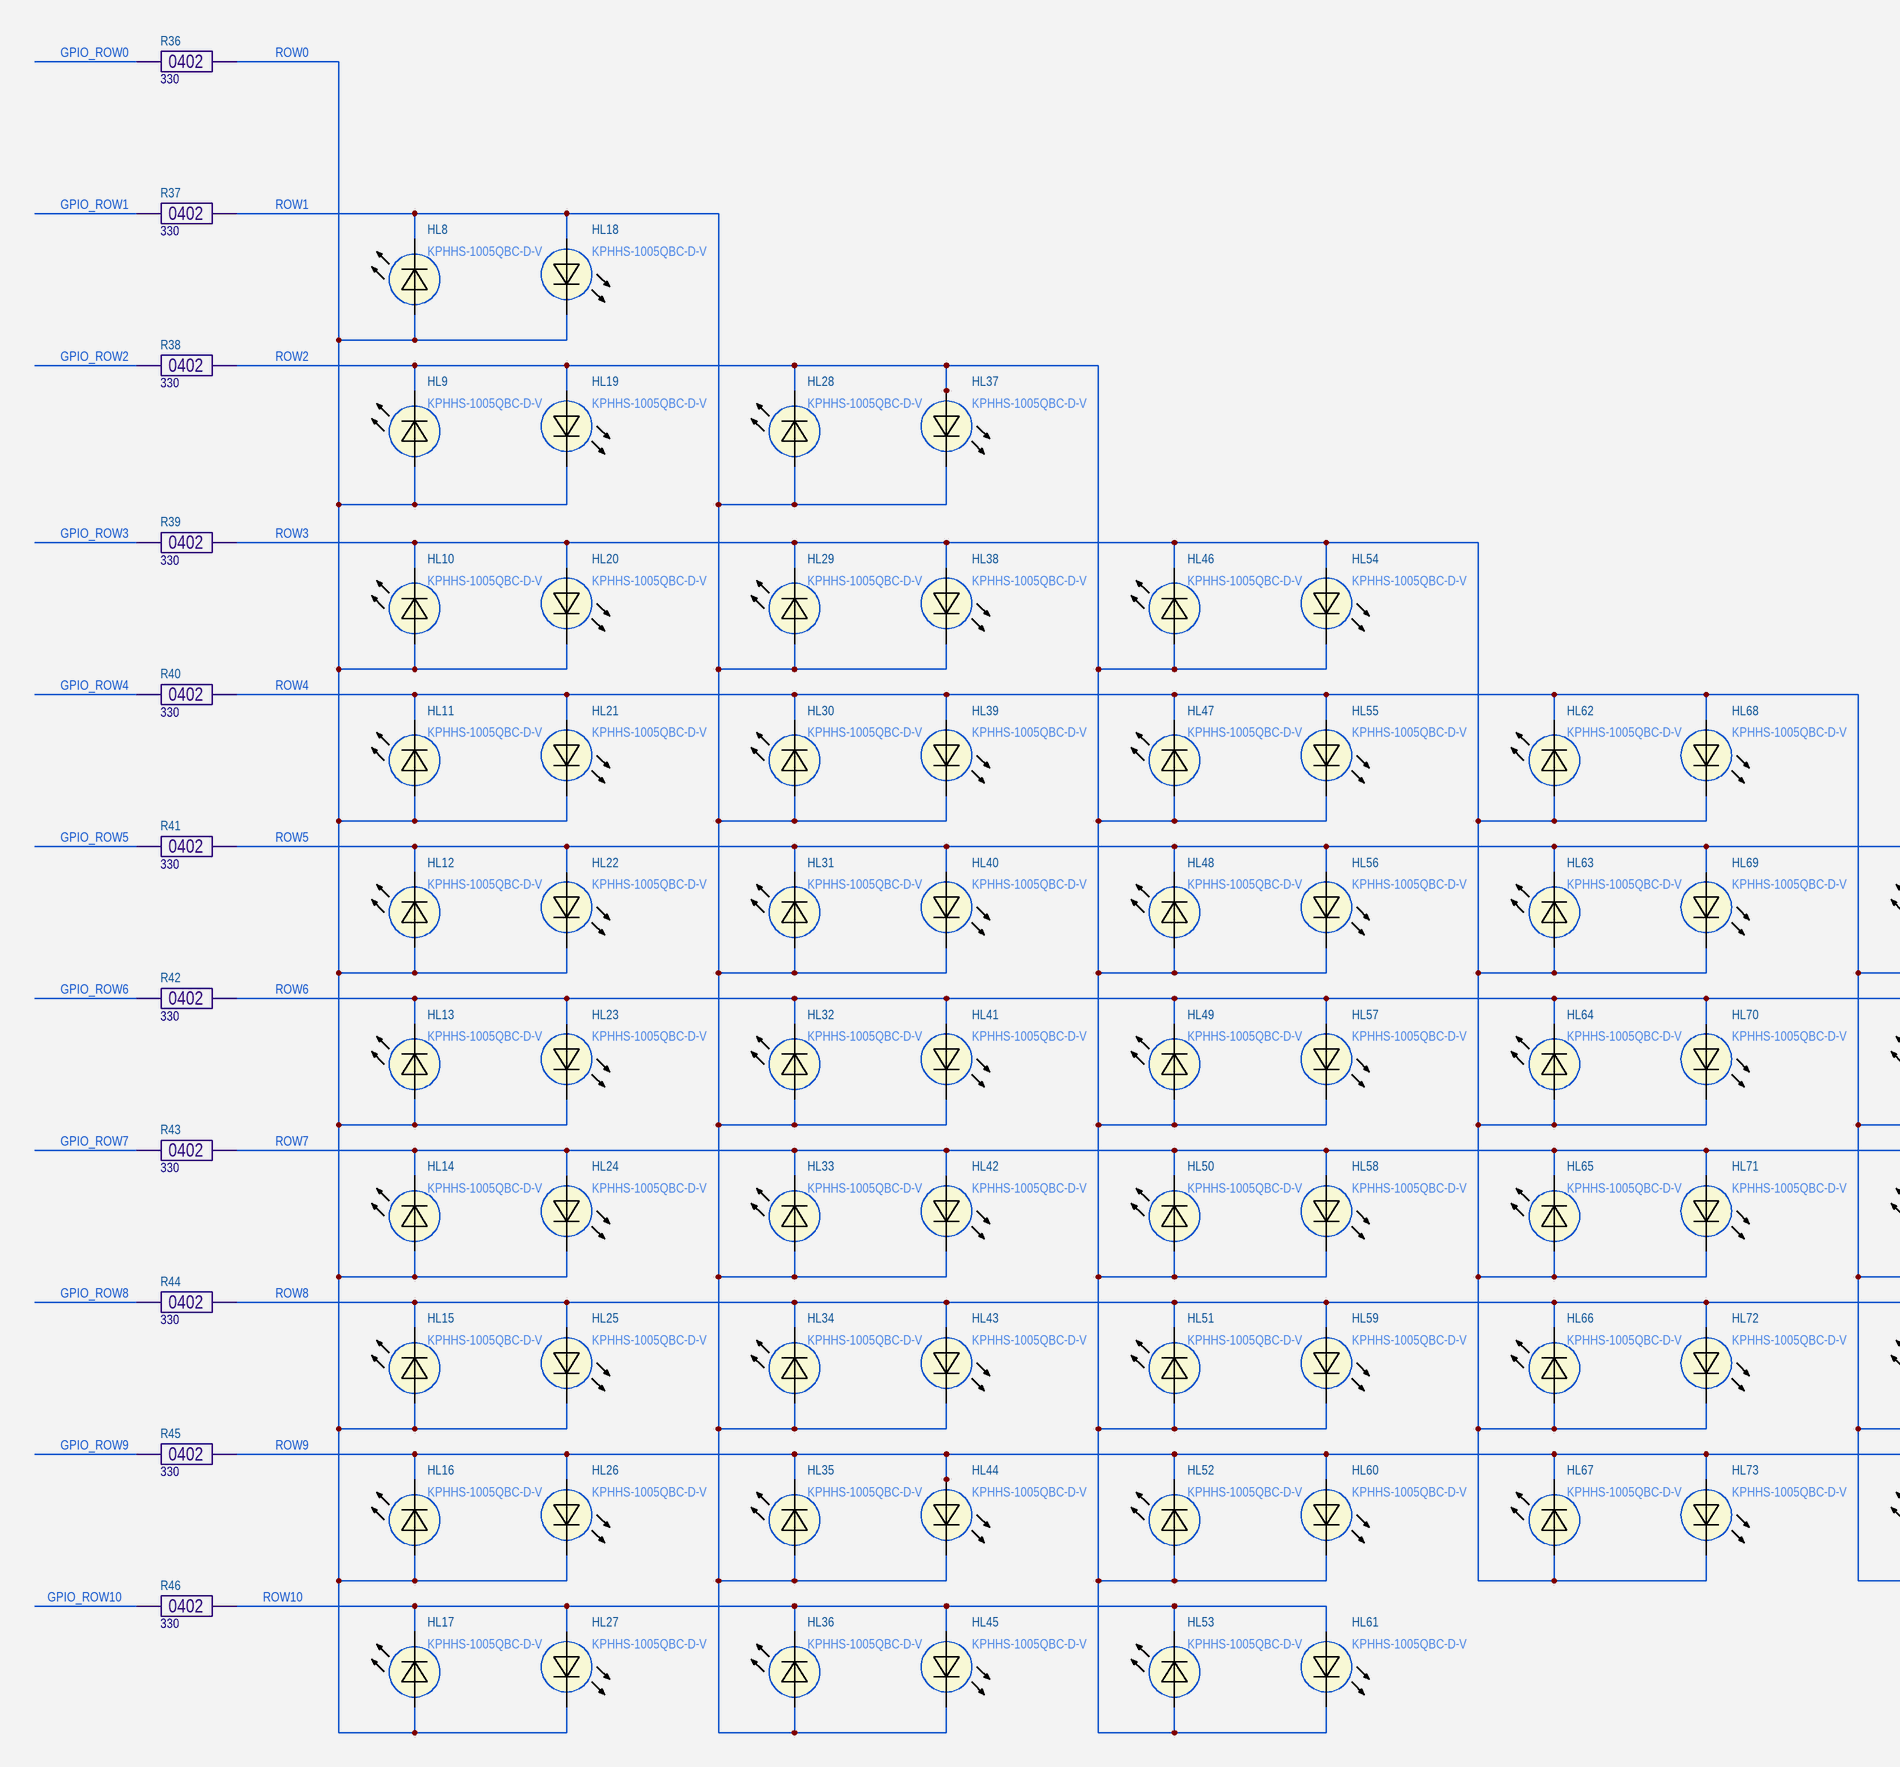
[diagram p6: p8_led_matrix.SchDoc, left]
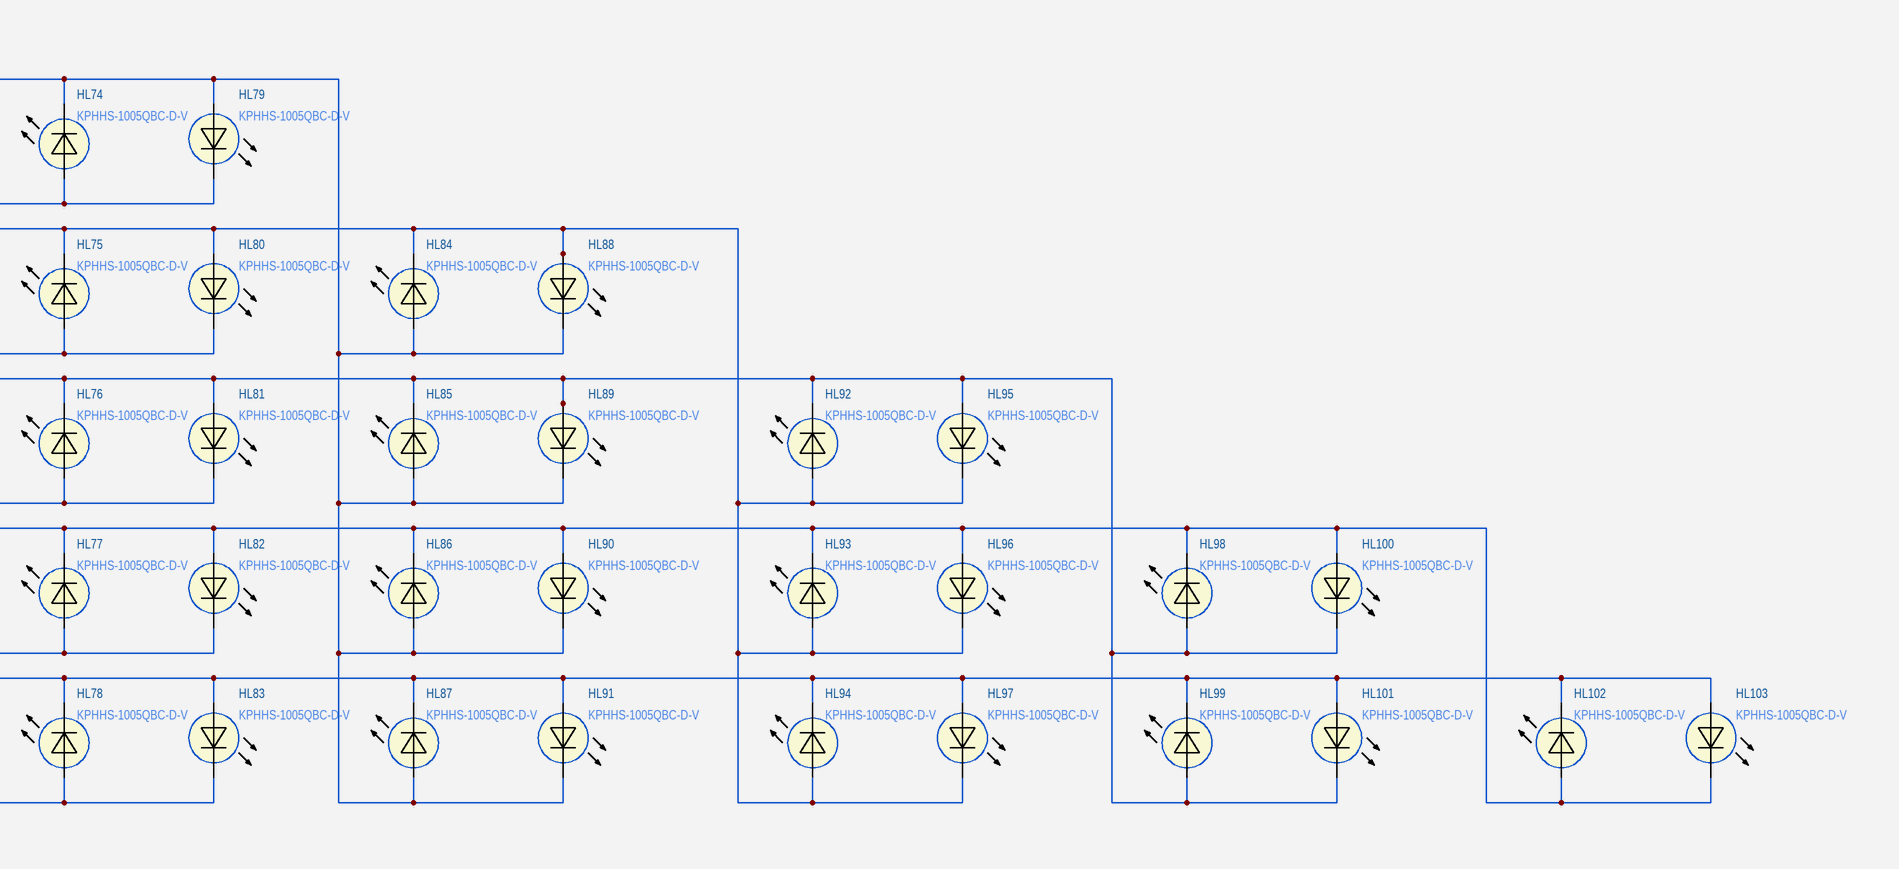
[diagram p7: p8_led_matrix.SchDoc, right]

### Parts
HL8  KPHHS-1005QBC-D-V  [LED0402B]
HL9  KPHHS-1005QBC-D-V  [LED0402B]
HL10  KPHHS-1005QBC-D-V  [LED0402B]
HL11  KPHHS-1005QBC-D-V  [LED0402B]
HL12  KPHHS-1005QBC-D-V  [LED0402B]
HL13  KPHHS-1005QBC-D-V  [LED0402B]
HL14  KPHHS-1005QBC-D-V  [LED0402B]
HL15  KPHHS-1005QBC-D-V  [LED0402B]
HL16  KPHHS-1005QBC-D-V  [LED0402B]
HL17  KPHHS-1005QBC-D-V  [LED0402B]
HL18  KPHHS-1005QBC-D-V  [LED0402B]
HL19  KPHHS-1005QBC-D-V  [LED0402B]
HL20  KPHHS-1005QBC-D-V  [LED0402B]
HL21  KPHHS-1005QBC-D-V  [LED0402B]
HL22  KPHHS-1005QBC-D-V  [LED0402B]
HL23  KPHHS-1005QBC-D-V  [LED0402B]
HL24  KPHHS-1005QBC-D-V  [LED0402B]
HL25  KPHHS-1005QBC-D-V  [LED0402B]
HL26  KPHHS-1005QBC-D-V  [LED0402B]
HL27  KPHHS-1005QBC-D-V  [LED0402B]
HL28  KPHHS-1005QBC-D-V  [LED0402B]
HL29  KPHHS-1005QBC-D-V  [LED0402B]
HL30  KPHHS-1005QBC-D-V  [LED0402B]
HL31  KPHHS-1005QBC-D-V  [LED0402B]
HL32  KPHHS-1005QBC-D-V  [LED0402B]
HL33  KPHHS-1005QBC-D-V  [LED0402B]
HL34  KPHHS-1005QBC-D-V  [LED0402B]
HL35  KPHHS-1005QBC-D-V  [LED0402B]
HL36  KPHHS-1005QBC-D-V  [LED0402B]
HL37  KPHHS-1005QBC-D-V  [LED0402B]
HL38  KPHHS-1005QBC-D-V  [LED0402B]
HL39  KPHHS-1005QBC-D-V  [LED0402B]
HL40  KPHHS-1005QBC-D-V  [LED0402B]
HL41  KPHHS-1005QBC-D-V  [LED0402B]
HL42  KPHHS-1005QBC-D-V  [LED0402B]
HL43  KPHHS-1005QBC-D-V  [LED0402B]
HL44  KPHHS-1005QBC-D-V  [LED0402B]
HL45  KPHHS-1005QBC-D-V  [LED0402B]
HL46  KPHHS-1005QBC-D-V  [LED0402B]
HL47  KPHHS-1005QBC-D-V  [LED0402B]
HL48  KPHHS-1005QBC-D-V  [LED0402B]
HL49  KPHHS-1005QBC-D-V  [LED0402B]
HL50  KPHHS-1005QBC-D-V  [LED0402B]
HL51  KPHHS-1005QBC-D-V  [LED0402B]
HL52  KPHHS-1005QBC-D-V  [LED0402B]
HL53  KPHHS-1005QBC-D-V  [LED0402B]
HL54  KPHHS-1005QBC-D-V  [LED0402B]
HL55  KPHHS-1005QBC-D-V  [LED0402B]
HL56  KPHHS-1005QBC-D-V  [LED0402B]
HL57  KPHHS-1005QBC-D-V  [LED0402B]
HL58  KPHHS-1005QBC-D-V  [LED0402B]
HL59  KPHHS-1005QBC-D-V  [LED0402B]
HL60  KPHHS-1005QBC-D-V  [LED0402B]
HL61  KPHHS-1005QBC-D-V  [LED0402B]
HL62  KPHHS-1005QBC-D-V  [LED0402B]
HL63  KPHHS-1005QBC-D-V  [LED0402B]
HL64  KPHHS-1005QBC-D-V  [LED0402B]
HL65  KPHHS-1005QBC-D-V  [LED0402B]
HL66  KPHHS-1005QBC-D-V  [LED0402B]
HL67  KPHHS-1005QBC-D-V  [LED0402B]
HL68  KPHHS-1005QBC-D-V  [LED0402B]
HL69  KPHHS-1005QBC-D-V  [LED0402B]
HL70  KPHHS-1005QBC-D-V  [LED0402B]
HL71  KPHHS-1005QBC-D-V  [LED0402B]
HL72  KPHHS-1005QBC-D-V  [LED0402B]
HL73  KPHHS-1005QBC-D-V  [LED0402B]
HL74  KPHHS-1005QBC-D-V  [LED0402B]
HL75  KPHHS-1005QBC-D-V  [LED0402B]
HL76  KPHHS-1005QBC-D-V  [LED0402B]
HL77  KPHHS-1005QBC-D-V  [LED0402B]
HL78  KPHHS-1005QBC-D-V  [LED0402B]
HL79  KPHHS-1005QBC-D-V  [LED0402B]
HL80  KPHHS-1005QBC-D-V  [LED0402B]
HL81  KPHHS-1005QBC-D-V  [LED0402B]
HL82  KPHHS-1005QBC-D-V  [LED0402B]
HL83  KPHHS-1005QBC-D-V  [LED0402B]
HL84  KPHHS-1005QBC-D-V  [LED0402B]
HL85  KPHHS-1005QBC-D-V  [LED0402B]
HL86  KPHHS-1005QBC-D-V  [LED0402B]
HL87  KPHHS-1005QBC-D-V  [LED0402B]
HL88  KPHHS-1005QBC-D-V  [LED0402B]
HL89  KPHHS-1005QBC-D-V  [LED0402B]
HL90  KPHHS-1005QBC-D-V  [LED0402B]
HL91  KPHHS-1005QBC-D-V  [LED0402B]
HL92  KPHHS-1005QBC-D-V  [LED0402B]
HL93  KPHHS-1005QBC-D-V  [LED0402B]
HL94  KPHHS-1005QBC-D-V  [LED0402B]
HL95  KPHHS-1005QBC-D-V  [LED0402B]
HL96  KPHHS-1005QBC-D-V  [LED0402B]
HL97  KPHHS-1005QBC-D-V  [LED0402B]
HL98  KPHHS-1005QBC-D-V  [LED0402B]
HL99  KPHHS-1005QBC-D-V  [LED0402B]
HL100  KPHHS-1005QBC-D-V  [LED0402B]
HL101  KPHHS-1005QBC-D-V  [LED0402B]
HL102  KPHHS-1005QBC-D-V  [LED0402B]
HL103  KPHHS-1005QBC-D-V  [LED0402B]
R36  330  Package: 0402  [RES0402B]
R37  330  Package: 0402  [RES0402B]
R38  330  Package: 0402  [RES0402B]
R39  330  Package: 0402  [RES0402B]
R40  330  Package: 0402  [RES0402B]
R41  330  Package: 0402  [RES0402B]
R42  330  Package: 0402  [RES0402B]
R43  330  Package: 0402  [RES0402B]
R44  330  Package: 0402  [RES0402B]
R45  330  Package: 0402  [RES0402B]
R46  330  Package: 0402  [RES0402B]

### Nets
GPIO_ROW0: R36.2
GPIO_ROW1: R37.2
GPIO_ROW2: R38.2
GPIO_ROW3: R39.2
GPIO_ROW4: R40.2
GPIO_ROW5: R41.2
GPIO_ROW6: R42.2
GPIO_ROW7: R43.2
GPIO_ROW8: R44.2
GPIO_ROW9: R45.2
GPIO_ROW10: R46.2
ROW0: HL8.2 HL9.2 HL10.2 HL11.2 HL12.2 HL13.2 HL14.2 HL15.2 HL16.2 HL17.2 HL18.1 HL19.1 HL20.1 HL21.1 HL22.1 HL23.1 HL24.1 HL25.1 HL26.1 HL27.1 R36.1
ROW1: HL8.1 HL18.2 HL28.2 HL29.2 HL30.2 HL31.2 HL32.2 HL33.2 HL34.2 HL35.2 HL36.2 HL37.1 HL38.1 HL39.1 HL40.1 HL41.1 HL42.1 HL43.1 HL44.1 HL45.1 R37.1
ROW2: HL9.1 HL19.2 HL28.1 HL37.2 HL46.2 HL47.2 HL48.2 HL49.2 HL50.2 HL51.2 HL52.2 HL53.2 HL54.1 HL55.1 HL56.1 HL57.1 HL58.1 HL59.1 HL60.1 HL61.1 R38.1
ROW3: HL10.1 HL20.2 HL29.1 HL38.2 HL46.1 HL54.2 HL62.2 HL63.2 HL64.2 HL65.2 HL66.2 HL67.2 HL68.1 HL69.1 HL70.1 HL71.1 HL72.1 HL73.1 R39.1
ROW4: HL11.1 HL21.2 HL30.1 HL39.2 HL47.1 HL55.2 HL62.1 HL68.2 HL74.2 HL75.2 HL76.2 HL77.2 HL78.2 HL79.1 HL80.1 HL81.1 HL82.1 HL83.1 R40.1
ROW5: HL12.1 HL22.2 HL31.1 HL40.2 HL48.1 HL56.2 HL63.1 HL69.2 HL74.1 HL79.2 HL84.2 HL85.2 HL86.2 HL87.2 HL88.1 HL89.1 HL90.1 HL91.1 R41.1
ROW6: HL13.1 HL23.2 HL32.1 HL41.2 HL49.1 HL57.2 HL64.1 HL70.2 HL75.1 HL80.2 HL84.1 HL88.2 HL92.2 HL93.2 HL94.2 HL95.1 HL96.1 HL97.1 R42.1
ROW7: HL14.1 HL24.2 HL33.1 HL42.2 HL50.1 HL58.2 HL65.1 HL71.2 HL76.1 HL81.2 HL85.1 HL89.2 HL92.1 HL95.2 HL98.2 HL99.2 HL100.1 HL101.1 R43.1
ROW8: HL15.1 HL25.2 HL34.1 HL43.2 HL51.1 HL59.2 HL66.1 HL72.2 HL77.1 HL82.2 HL86.1 HL90.2 HL93.1 HL96.2 HL98.1 HL100.2 HL102.2 HL103.1 R44.1
ROW9: HL16.1 HL26.2 HL35.1 HL44.2 HL52.1 HL60.2 HL67.1 HL73.2 HL78.1 HL83.2 HL87.1 HL91.2 HL94.1 HL97.2 HL99.1 HL101.2 HL102.1 HL103.2 R45.1
ROW10: HL17.1 HL27.2 HL36.1 HL45.2 HL53.1 HL61.2 R46.1

### Notes on the sheet
- A1
- GitHub <https://github.com/kirra-cat/druino-uno>
- view on

### Library data of the parts
HL8-HL103 = KPHHS-1005QBC-D-V: as HL7 on sheet p6_wch_link; Package: 0402; Part Number: KPHHS-1005QBC-D-V; Color: Blue
R36-R46 = R0402: Resistor 0402 package case; Part Number: RC0402FR-07330RL; Manufacturer: Yageo; Tolerance: ± 1 %; Temperature Coefficient: ±100 ppm/K; Value: 330; Value on schem: 330

## Nets that join several sheets
CH32_RESET#: p3_mcu (5 pins), p4_esp32 (R14.2), p7_power (DA2.5)
CH32_SWCLK: p3_mcu (DD1.49), p6_wch_link (DD2.2)
CH32_SWDIO: p3_mcu (DD1.46), p6_wch_link (DD2.1)
ESP32_IO: p3_mcu (XS1.1), p4_esp32 (A1.13 KT14.1)
ESP32_USB_N: p4_esp32 (A1.23), p6_wch_link (DD3.3)
ESP32_USB_P: p4_esp32 (A1.24), p6_wch_link (DD3.7)
GND: p3_mcu (33 pins), p4_esp32 (26 pins), p6_wch_link (14 pins), p7_power (14 pins)
VCC_3V3: p3_mcu (25 pins), p4_esp32 (7 pins), p6_wch_link (9 pins), p7_power (5 pins)
VCC_BAT: p3_mcu (VD8.2), p7_power (XP2.3)
VCC_IN: p3_mcu (XS1.8), p7_power (VD12.2 XS7.4)
VCC_SYS: p6_wch_link (VD13.1), p7_power (5 pins)
WCH_LINK_RX: p4_esp32 (R13.1 XP1.5), p6_wch_link (DD2.7)
WCH_LINK_TX: p4_esp32 (R12.1 XP1.3), p6_wch_link (DD2.8)
CHANNEL_RX: p3_mcu (DD1.27), p4_esp32 (A1.21)
CHANNEL_TX: p3_mcu (DD1.26), p4_esp32 (A1.22)
GPIO_ROW0: p3_mcu (DD1.51), p8_led_matrix (R36.2)
GPIO_ROW1: p3_mcu (DD1.52), p8_led_matrix (R37.2)
GPIO_ROW2: p3_mcu (DD1.54), p8_led_matrix (R38.2)
GPIO_ROW3: p3_mcu (DD1.8), p8_led_matrix (R39.2)
GPIO_ROW4: p3_mcu (DD1.53), p8_led_matrix (R40.2)
GPIO_ROW5: p3_mcu (DD1.9), p8_led_matrix (R41.2)
GPIO_ROW6: p3_mcu (DD1.25), p8_led_matrix (R42.2)
GPIO_ROW7: p3_mcu (DD1.24), p8_led_matrix (R43.2)
GPIO_ROW8: p3_mcu (DD1.2), p8_led_matrix (R44.2)
GPIO_ROW9: p3_mcu (DD1.11), p8_led_matrix (R45.2)
GPIO_ROW10: p3_mcu (DD1.10), p8_led_matrix (R46.2)
USER_IO_15: p3_mcu (DD1.22), p4_esp32 (A1.19)
USER_IO_16: p3_mcu (DD1.23), p4_esp32 (A1.20)